# Altium project LimePSB-RPCM_1v5.PrjPcb (part 1 of 10)
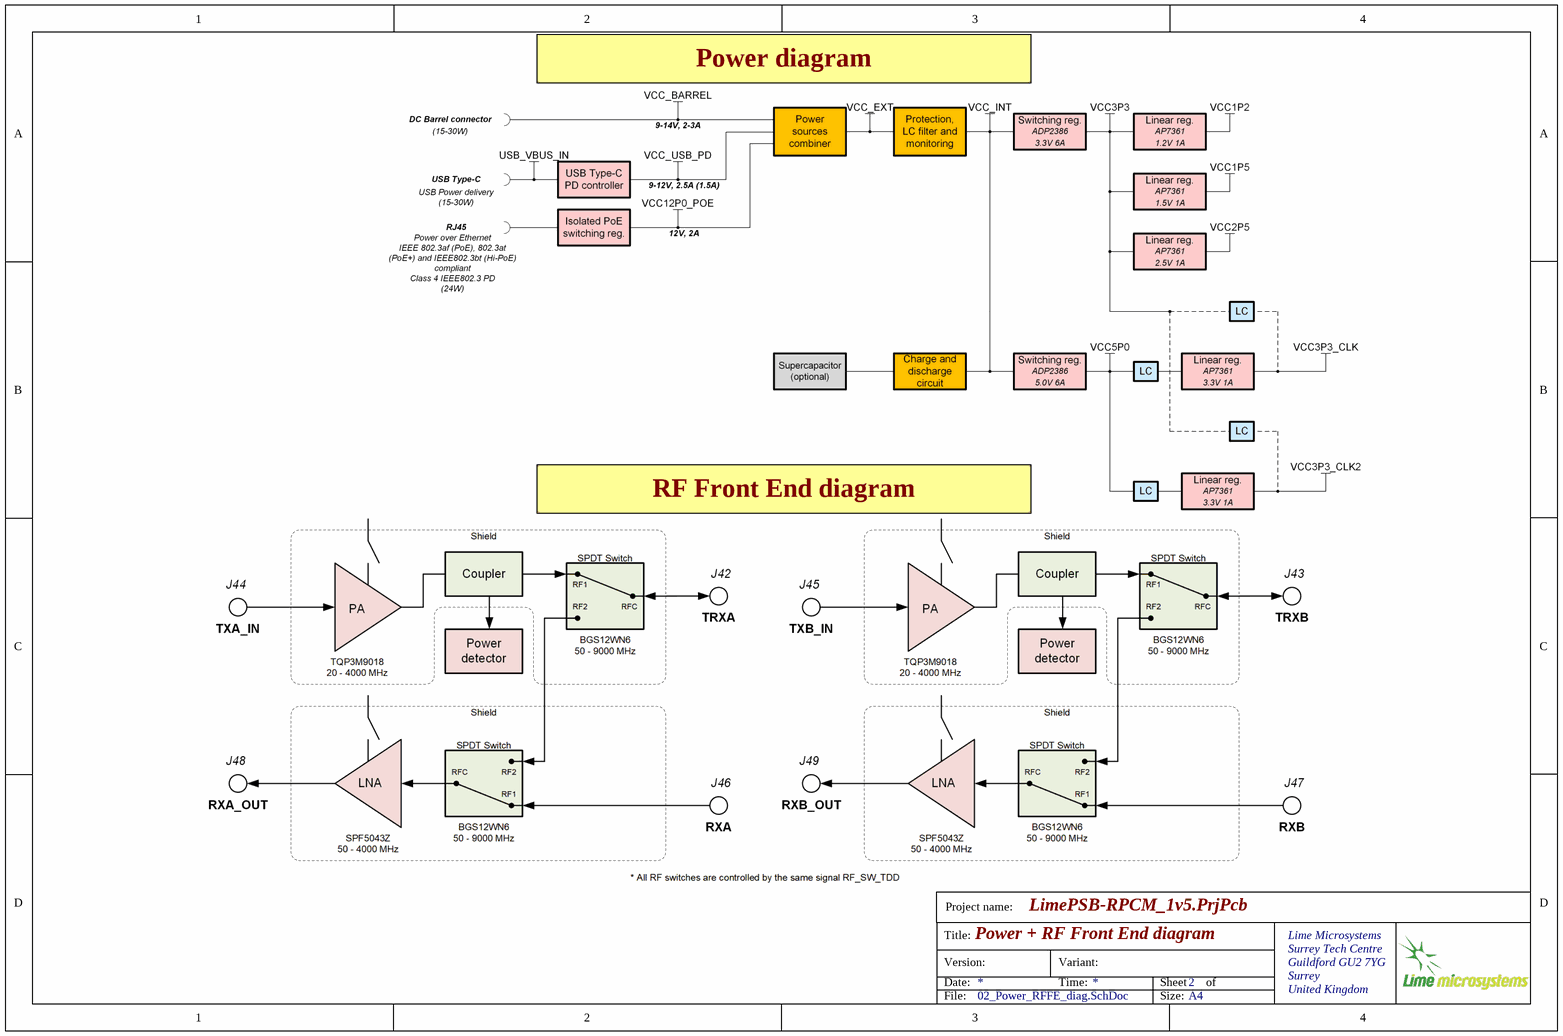
[diagram p0: 02_Power_RFFE_diag.SchDoc]
PROJECT_VERSION: 1.5; SHEET_TOTAL: 15
10 sheets, 793 parts. Net scope: global (net labels, ports and power ports of the same name join across sheets).
Board file: LimePSB-RPCM_1v5.PcbDoc
Sheets:
  02_Power_RFFE_diag.SchDoc
  03_Clock_diag.SchDoc
  05_RPi_mPCIe.SchDoc
  07_Misc_2.SchDoc
  08_FPGA.SchDoc
  11_Clock_1.SchDoc
  12_Clock_2.SchDoc
  13_RFFE.SchDoc
  14_RFPD_PoE_USB_PD.SchDoc
  15_Power.SchDoc

## Sheet 02_Power_RFFE_diag.SchDoc: Power + RF Front End diagram
size A4; Organization: Lime Microsystems; Address1: Surrey Tech Centre; Address2: Guildford GU2 7YG; Address3: Surrey; Address4: United Kingdom; Revision: 1.5; SheetNumber: 2; SheetTotal: 15

### Notes on the sheet
- Power diagram
- RF Front End diagram
- Project name:
- Title:
- Version:
- Date:
- Variant:
- Time:
- Sheet
- of
- File:
- Size:
- A4

## Sheet 03_Clock_diag.SchDoc: Clock diagram
size A4; Organization: Lime Microsystems; Address1: Surrey Tech Centre; Address2: Guildford GU2 7YG; Address3: Surrey; Address4: United Kingdom; Revision: 1.5; SheetNumber: 3; SheetTotal: 15
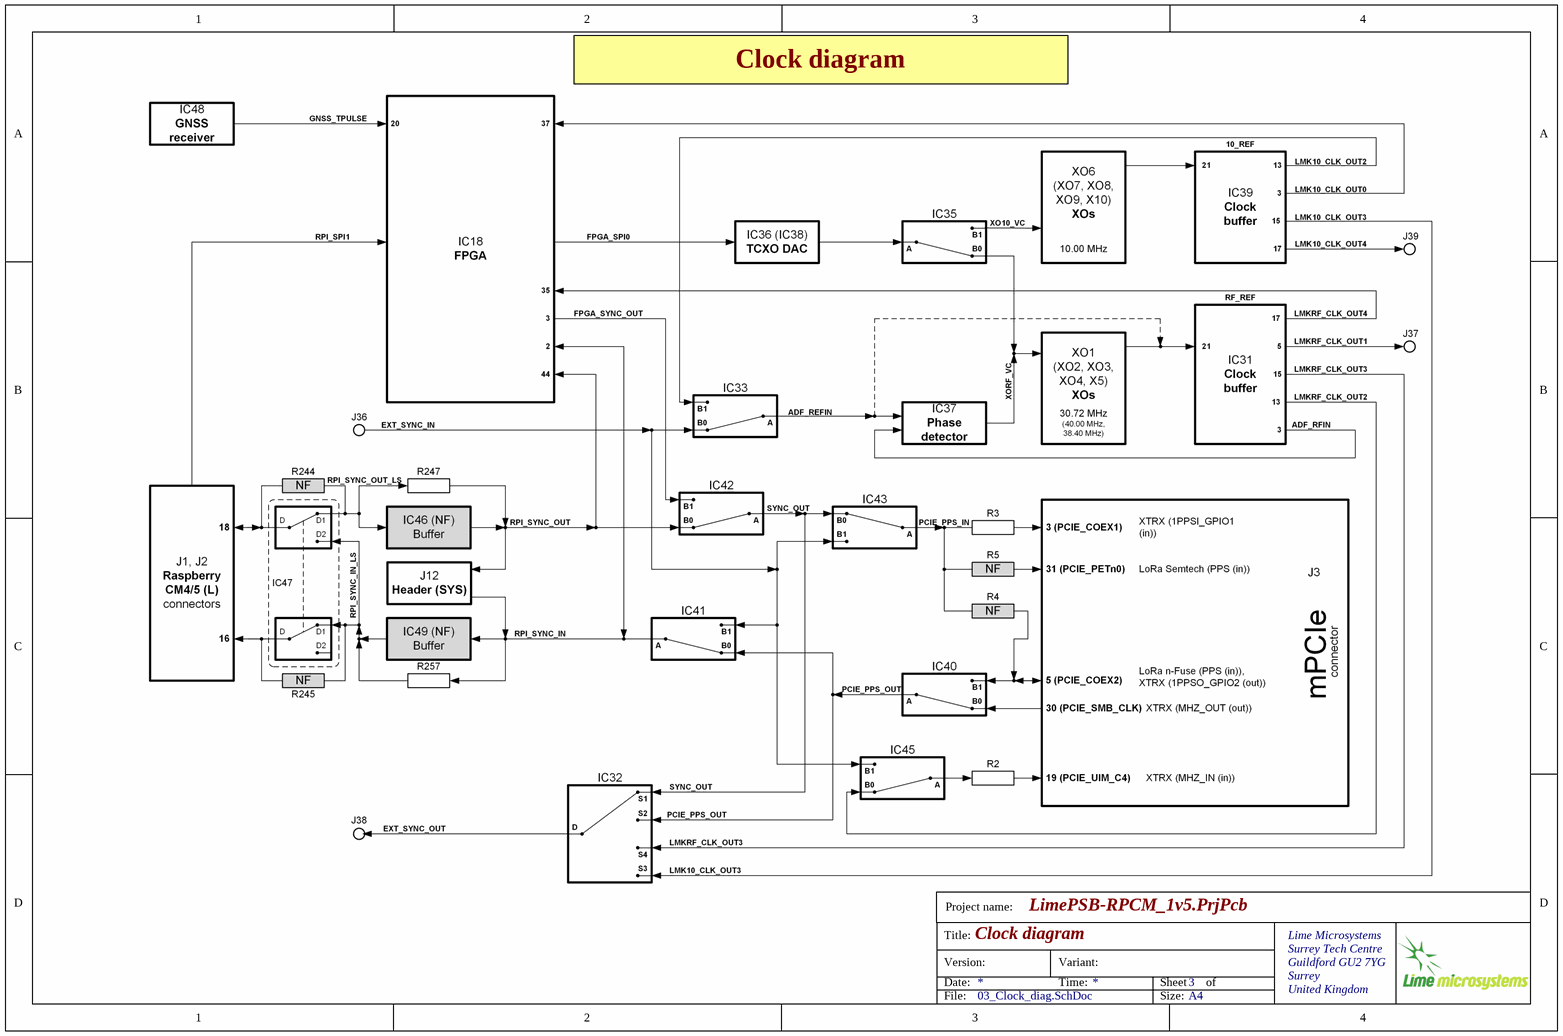
[diagram p1: 03_Clock_diag.SchDoc]

### Notes on the sheet
- Clock diagram
- Project name:
- Title:
- Version:
- Date:
- Variant:
- Time:
- Sheet
- of
- File:
- Size:
- A4

## Sheet 05_RPi_mPCIe.SchDoc: Raspberry Pi CM4/5(L) and mPCIe
size A3; Organization: Lime Microsystems; Address1: Surrey Tech Centre; Address2: Guildford GU2 7YG; Address3: Surrey; Address4: United Kingdom; Revision: 1.5; SheetNumber: 5; SheetTotal: 15
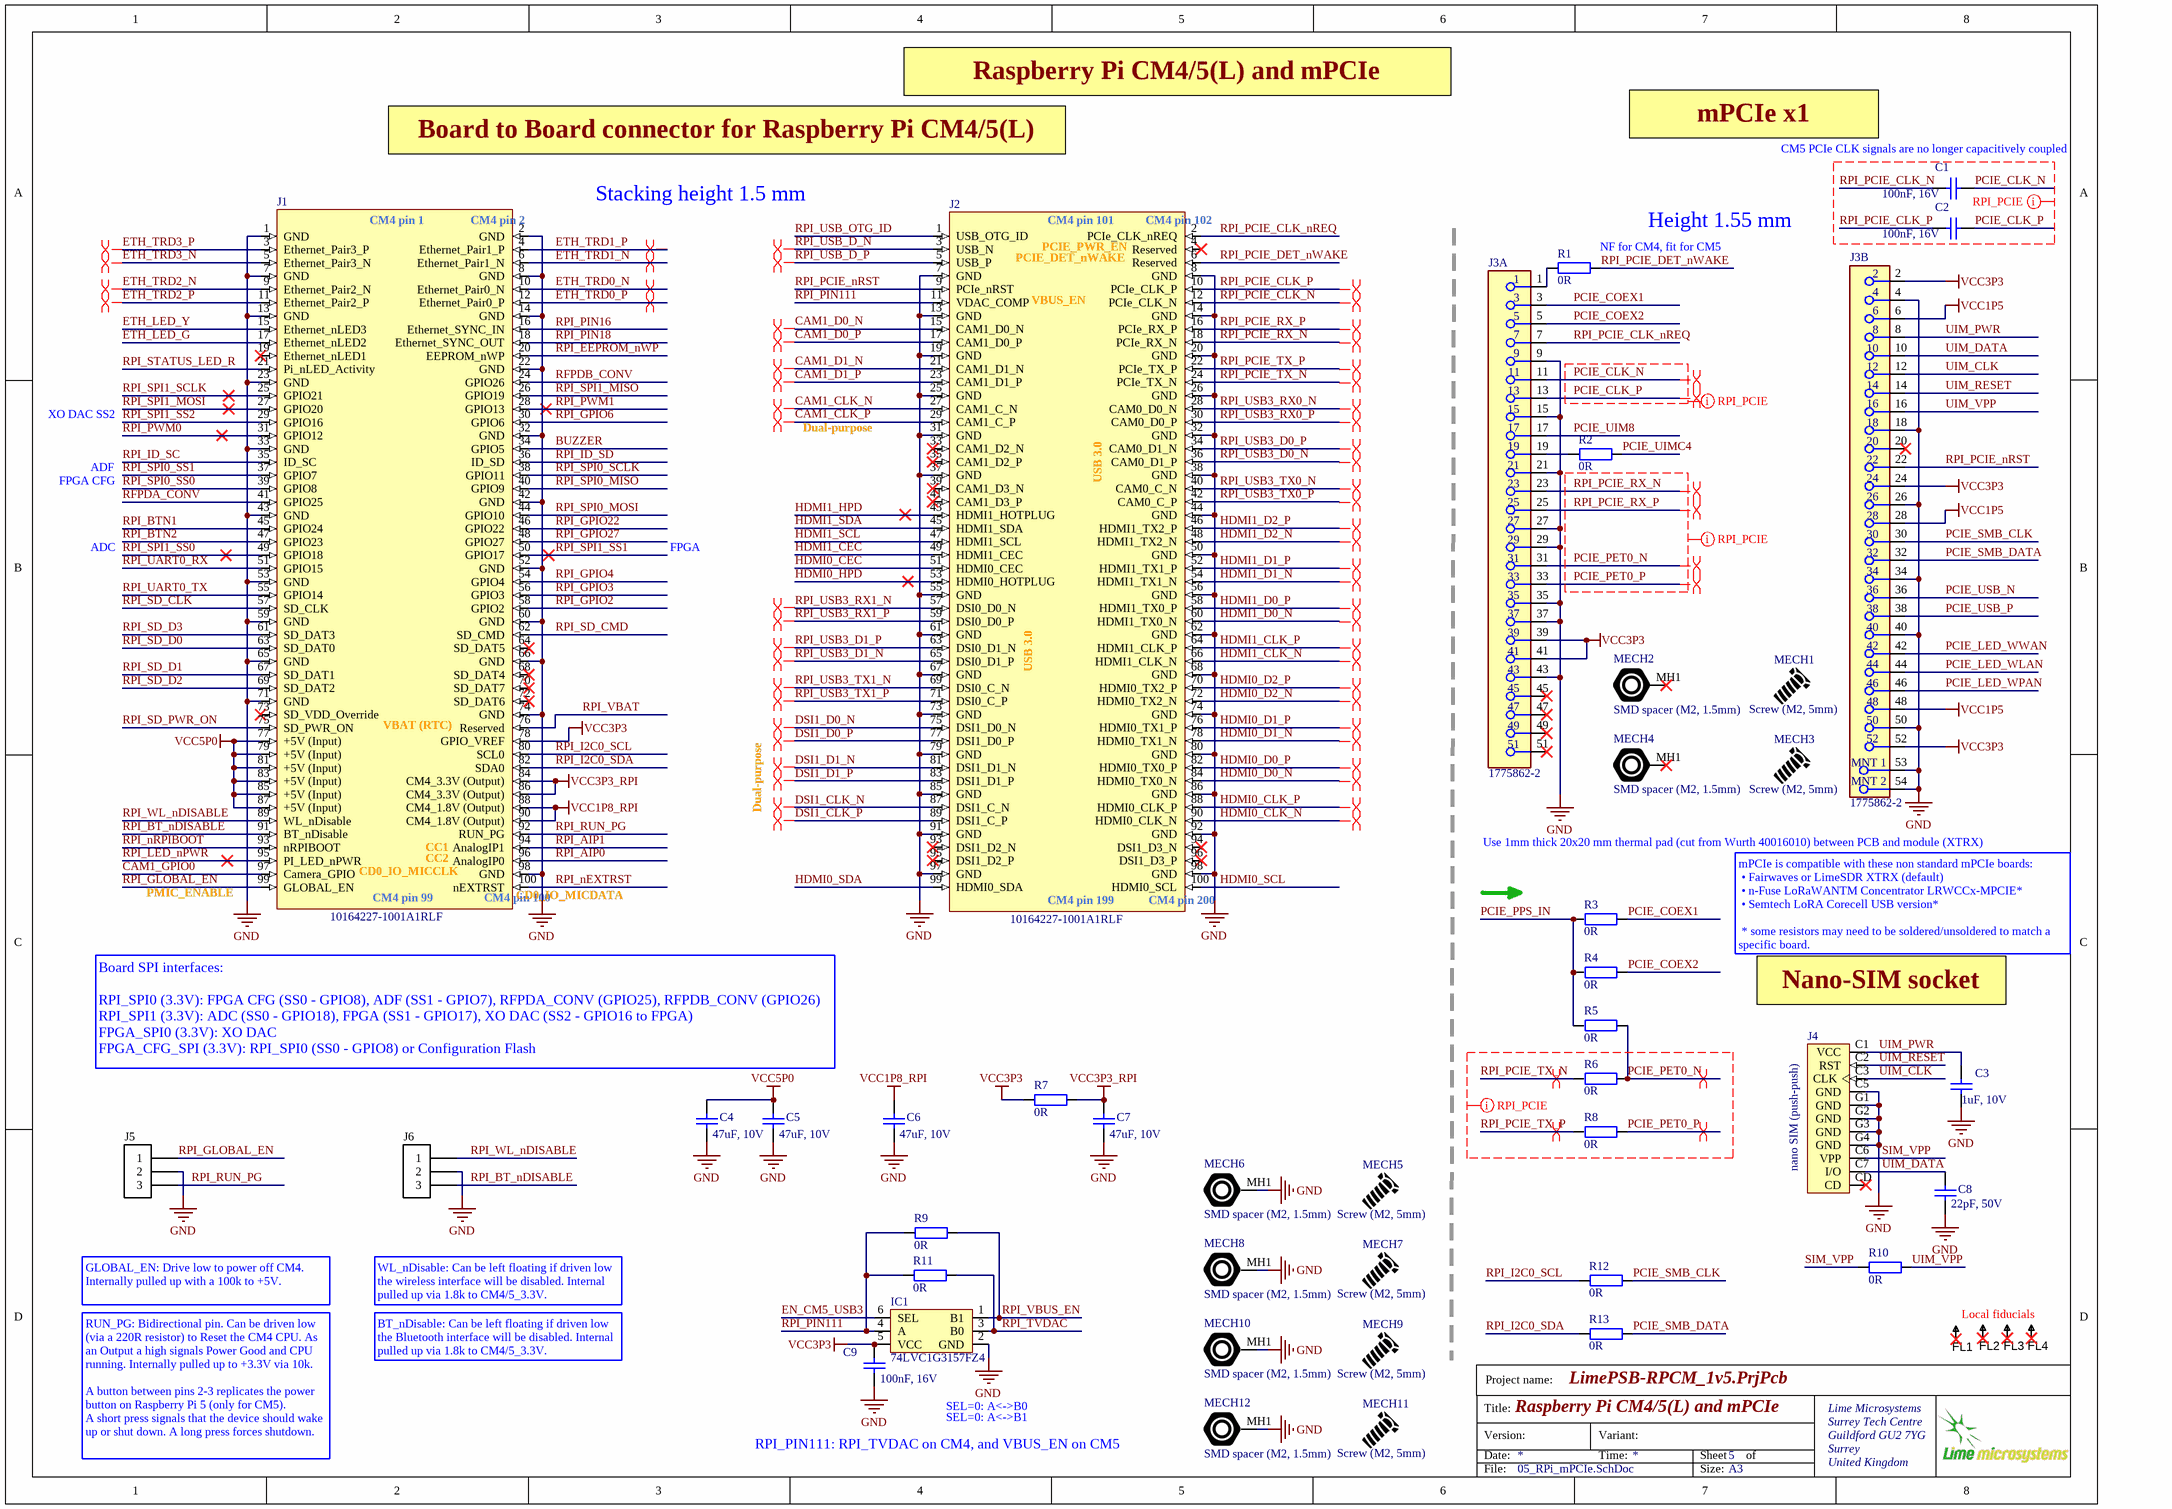
[diagram p2: 05_RPi_mPCIe.SchDoc]

### Parts
C1  100nF, 16V  [CAP0402]
C2  100nF, 16V  [CAP0402]
C3  1uF, 10V  [CAP0402]
C4  47uF, 10V  [CAP1206]
C5  47uF, 10V  [CAP1206]
C6  47uF, 10V  [CAP1206]
C7  47uF, 10V  [CAP1206]
C8  22pF, 50V  [CAP0402]
C9  100nF, 16V  [CAP0402]
FL1  Fiducial  [Fiducial_local]  (value not drawn)
FL2  Fiducial  [Fiducial_local]  (value not drawn)
FL3  Fiducial  [Fiducial_local]  (value not drawn)
FL4  Fiducial  [Fiducial_local]  (value not drawn)
IC1  74LVC1G3157FZ4  [74LVC1G3157FZ4_SPDT_SW_DFN1410-6]
J1  Manufacturer Part Number 1: 10164227-1001A1RLF  [FP-DF40C-100DS-0.4V(51)]  (hidden comment: Board to Board & Mezzanine Connectors BergStak 0.4mm, 100 position, Receptacle, 1.5mm stack height)
J2  Manufacturer Part Number 1: 10164227-1001A1RLF  [FP-DF40C-100DS-0.4V(51)]  (hidden comment: Board to Board & Mezzanine Connectors BergStak 0.4mm, 100 position, Receptacle, 1.5mm stack height)
J3  1775862-2  [MiniPCIe_connector_XTRX_v2]  (parts A,B of 2)
J4  nano SIM (push-push)  [nano_SIM_SIM8066-6-1-14-01-A]
J5  Header 3x1 pin  [HDR_1x3]  (value not drawn)
J6  Header 3x1 pin  [HDR_1x3]  (value not drawn)
MECH1  Screw (M2, 5mm)  (mechanical)
MECH2  SMD spacer (M2, 1.5mm)  [9774015243R_SMT_M2_STANDOFF_SPACER]
MECH3  Screw (M2, 5mm)  (mechanical)
MECH4  SMD spacer (M2, 1.5mm)  [9774015243R_SMT_M2_STANDOFF_SPACER]
MECH5  Screw (M2, 5mm)  (mechanical)
MECH6  SMD spacer (M2, 1.5mm)  [9774015243R_SMT_M2_STANDOFF_SPACER]
MECH7  Screw (M2, 5mm)  (mechanical)
MECH8  SMD spacer (M2, 1.5mm)  [9774015243R_SMT_M2_STANDOFF_SPACER]
MECH9  Screw (M2, 5mm)  (mechanical)
MECH10  SMD spacer (M2, 1.5mm)  [9774015243R_SMT_M2_STANDOFF_SPACER]
MECH11  Screw (M2, 5mm)  (mechanical)
MECH12  SMD spacer (M2, 1.5mm)  [9774015243R_SMT_M2_STANDOFF_SPACER]
R1  0R  [RES0402]
R2  0R  [RES0402_v2]
R3  0R  [RES0402]
R4  0R  [RES0402]
R5  0R  [RES0402]
R6  0R  [RES0402]
R7  0R  [RES0805]
R8  0R  [RES0402]
R9  0R  [RES0402]
R10  0R  [RES0402]
R11  0R  [RES0402]
R12  0R  [RES0402]
R13  0R  [RES0402]

### Nets
GND: C3.1 C4.1 C5.1 C6.1 C7.1 C8.1 C9.2 IC1.2(GND) J1.1(GND) J1.2(GND) J1.7(GND) J1.8(GND) J1.13(GND) J1.14(GND) J1.22(GND) J1.23(GND) J1.32(GND) J1.33(GND) J1.42(GND) J1.43(GND) J1.52(GND) J1.53(GND) J1.59(GND) J1.60(GND) J1.65(GND) J1.66(GND) J1.71(GND) J1.74(GND) J1.98(GND) J2.7(GND) J2.8(GND) J2.13(GND) J2.14(GND) J2.19(GND) J2.20(GND) J2.25(GND) J2.26(GND) J2.31(GND) J2.32(GND) J2.37(GND) J2.38(GND) J2.44(GND) J2.50(GND) J2.55(GND) J2.56(GND) J2.61(GND) J2.62(GND) J2.67(GND) J2.68(GND) J2.73(GND) J2.74(GND) J2.79(GND) J2.80(GND) J2.85(GND) J2.86(GND) J2.91(GND) J2.92(GND) J2.97(GND) J2.98(GND) J3.4 J3.9 J3.15 J3.18 J3.21 J3.26 J3.27 J3.29 J3.34 J3.35 J3.37 J3.40 J3.43 J3.50 J3.53(MNT_1) J3.54(MNT_2) J4.C5(GND) J4.G1(GND) J4.G2(GND) J4.G3(GND) J4.G4(GND) J5.2 J6.2 MECH6.MH1(GND) MECH8.MH1(GND) MECH10.MH1(GND) MECH12.MH1(GND)
VCC1P5: J3.6 J3.28 J3.48
VCC1P8_RPI: C6.2 J1.88(CM4_1.8V_(Output)) J1.90(CM4_1.8V_(Output))
VCC3P3: C9.1 IC1.5(VCC) J1.78(GPIO_VREF) J3.2 J3.24 J3.39 J3.41 J3.52 R7.2
VCC3P3_RPI: C7.2 J1.84(CM4_3.3V_(Output)) J1.86(CM4_3.3V_(Output)) R7.1
VCC5P0: C4.2 C5.2 J1.77(+5V_(Input)) J1.79(+5V_(Input)) J1.81(+5V_(Input)) J1.83(+5V_(Input)) J1.85(+5V_(Input)) J1.87(+5V_(Input))
BUZZER: J1.34(GPIO5)
CAM1_CLK_N: J2.27(CAM1_C_N)
CAM1_CLK_P: J2.29(CAM1_C_P)
CAM1_D0_N: J2.15(CAM1_D0_N)
CAM1_D0_P: J2.17(CAM1_D0_P)
CAM1_D1_N: J2.21(CAM1_D1_N)
CAM1_D1_P: J2.23(CAM1_D1_P)
CAM1_GPIO0: J1.97(Camera_GPIO)
DSI1_CLK_N: J2.87(DSI1_C_N)
DSI1_CLK_P: J2.89(DSI1_C_P)
DSI1_D0_N: J2.75(DSI1_D0_N)
DSI1_D0_P: J2.77(DSI1_D0_P)
DSI1_D1_N: J2.81(DSI1_D1_N)
DSI1_D1_P: J2.83(DSI1_D1_P)
EN_CM5_USB3: IC1.6(SEL)
ETH_LED_G: J1.17(Ethernet_nLED2)
ETH_LED_Y: J1.15(Ethernet_nLED3)
ETH_TRD0_N: J1.10(Ethernet_Pair0_N)
ETH_TRD0_P: J1.12(Ethernet_Pair0_P)
ETH_TRD1_N: J1.6(Ethernet_Pair1_N)
ETH_TRD1_P: J1.4(Ethernet_Pair1_P)
ETH_TRD2_N: J1.9(Ethernet_Pair2_N)
ETH_TRD2_P: J1.11(Ethernet_Pair2_P)
ETH_TRD3_N: J1.5(Ethernet_Pair3_N)
ETH_TRD3_P: J1.3(Ethernet_Pair3_P)
HDMI0_CEC: J2.51(HDMI0_CEC)
HDMI0_CLK_N: J2.90(HDMI0_CLK_N)
HDMI0_CLK_P: J2.88(HDMI0_CLK_P)
HDMI0_D0_N: J2.84(HDMI0_TX0_N)
HDMI0_D0_P: J2.82(HDMI0_TX0_P)
HDMI0_D1_N: J2.78(HDMI0_TX1_N)
HDMI0_D1_P: J2.76(HDMI0_TX1_P)
HDMI0_D2_N: J2.72(HDMI0_TX2_N)
HDMI0_D2_P: J2.70(HDMI0_TX2_P)
HDMI0_HPD: J2.53(HDMI0_HOTPLUG)
HDMI0_SCL: J2.100(HDMI0_SCL)
HDMI0_SDA: J2.99(HDMI0_SDA)
HDMI1_CEC: J2.49(HDMI1_CEC)
HDMI1_CLK_N: J2.66(HDMI1_CLK_N)
HDMI1_CLK_P: J2.64(HDMI1_CLK_P)
HDMI1_D0_N: J2.60(HDMI1_TX0_N)
HDMI1_D0_P: J2.58(HDMI1_TX0_P)
HDMI1_D1_N: J2.54(HDMI1_TX1_N)
HDMI1_D1_P: J2.52(HDMI1_TX1_P)
HDMI1_D2_N: J2.48(HDMI1_TX2_N)
HDMI1_D2_P: J2.46(HDMI1_TX2_P)
HDMI1_HPD: J2.43(HDMI1_HOTPLUG)
HDMI1_SCL: J2.47(HDMI1_SCL)
HDMI1_SDA: J2.45(HDMI1_SDA)
PCIE_CLK_N: C1.1 J3.11
PCIE_CLK_P: C2.1 J3.13
PCIE_COEX1: J3.3 R3.1
PCIE_COEX2: J3.5 R4.1
PCIE_LED_WLAN: J3.44
PCIE_LED_WPAN: J3.46
PCIE_LED_WWAN: J3.42
PCIE_PET0_N: J3.31 R5.1 R6.1
PCIE_PET0_P: J3.33 R8.1
PCIE_PPS_IN: R3.2 R4.2 R5.2
PCIE_SMB_CLK: J3.30 R12.1
PCIE_SMB_DATA: J3.32 R13.1
PCIE_UIM8: J3.17
PCIE_UIMC4: R2.1
PCIE_USB_N: J3.36
PCIE_USB_P: J3.38
RFPDA_CONV: J1.41(GPIO25)
RFPDB_CONV: J1.24(GPIO26)
RPI_AIP0: J1.96(AnalogIP0)
RPI_AIP1: J1.94(AnalogIP1)
RPI_BT_nDISABLE: J1.91(BT_nDisable) J6.3
RPI_BTN1: J1.45(GPIO24)
RPI_BTN2: J1.47(GPIO23)
RPI_EEPROM_nWP: J1.20(EEPROM_nWP)
RPI_GLOBAL_EN: J1.99(GLOBAL_EN) J5.1
RPI_GPIO2: J1.58(GPIO2)
RPI_GPIO3: J1.56(GPIO3)
RPI_GPIO4: J1.54(GPIO4)
RPI_GPIO6: J1.30(GPIO6)
RPI_GPIO22: J1.46(GPIO22)
RPI_GPIO27: J1.48(GPIO27)
RPI_I2C0_SCL: J1.80(SCL0) R12.2
RPI_I2C0_SDA: J1.82(SDA0) R13.2
RPI_ID_SC: J1.35(ID_SC)
RPI_ID_SD: J1.36(ID_SD)
RPI_LED_nPWR: J1.95(PI_LED_nPWR)
RPI_nEXTRST: J1.100(nEXTRST)
RPI_nRPIBOOT: J1.93(nRPIBOOT)
RPI_PCIE_CLK_N: C1.2 J2.12(PCIe_CLK_N)
RPI_PCIE_CLK_nREQ: J2.2(PCIe_CLK_nREQ) J3.7
RPI_PCIE_CLK_P: C2.2 J2.10(PCIe_CLK_P)
RPI_PCIE_DET_nWAKE: J2.6(Reserved) R1.1
RPI_PCIE_nRST: J2.9(PCIe_nRST) J3.22
RPI_PCIE_RX_N: J2.18(PCIe_RX_N) J3.23
RPI_PCIE_RX_P: J2.16(PCIe_RX_P) J3.25
RPI_PCIE_TX_N: J2.24(PCIe_TX_N) R6.2
RPI_PCIE_TX_P: J2.22(PCIe_TX_P) R8.2
RPI_PIN16: J1.16(Ethernet_SYNC_IN)
RPI_PIN18: J1.18(Ethernet_SYNC_OUT)
RPI_PIN111: IC1.4(A) J2.11(VDAC_COMP) R9.2 R11.2
RPI_PWM0: J1.31(GPIO12)
RPI_PWM1: J1.28(GPIO13)
RPI_RUN_PG: J1.92(RUN_PG) J5.3
RPI_SD_CLK: J1.57(SD_CLK)
RPI_SD_CMD: J1.62(SD_CMD)
RPI_SD_D0: J1.63(SD_DAT0)
RPI_SD_D1: J1.67(SD_DAT1)
RPI_SD_D2: J1.69(SD_DAT2)
RPI_SD_D3: J1.61(SD_DAT3)
RPI_SD_PWR_ON: J1.75(SD_PWR_ON)
RPI_SPI0_MISO: J1.40(GPIO9)
RPI_SPI0_MOSI: J1.44(GPIO10)
RPI_SPI0_SCLK: J1.38(GPIO11)
RPI_SPI0_SS0: J1.39(GPIO8)
RPI_SPI0_SS1: J1.37(GPIO7)
RPI_SPI1_MISO: J1.26(GPIO19)
RPI_SPI1_MOSI: J1.27(GPIO20)
RPI_SPI1_SCLK: J1.25(GPIO21)
RPI_SPI1_SS0: J1.49(GPIO18)
RPI_SPI1_SS1: J1.50(GPIO17)
RPI_SPI1_SS2: J1.29(GPIO16)
RPI_STATUS_LED_R: J1.21(Pi_nLED_Activity)
RPI_TVDAC: IC1.3(B0) R11.1
RPI_UART0_RX: J1.51(GPIO15)
RPI_UART0_TX: J1.55(GPIO14)
RPI_USB3_D0_N: J2.36(CAM0_D1_P)
RPI_USB3_D0_P: J2.34(CAM0_D1_N)
RPI_USB3_D1_N: J2.65(DSI0_D1_P)
RPI_USB3_D1_P: J2.63(DSI0_D1_N)
RPI_USB3_RX0_N: J2.28(CAM0_D0_N)
RPI_USB3_RX0_P: J2.30(CAM0_D0_P)
RPI_USB3_RX1_N: J2.57(DSI0_D0_N)
RPI_USB3_RX1_P: J2.59(DSI0_D0_P)
RPI_USB3_TX0_N: J2.40(CAM0_C_N)
RPI_USB3_TX0_P: J2.42(CAM0_C_P)
RPI_USB3_TX1_N: J2.69(DSI0_C_N)
RPI_USB3_TX1_P: J2.71(DSI0_C_P)
RPI_USB_D_N: J2.3(USB_N)
RPI_USB_D_P: J2.5(USB_P)
RPI_USB_OTG_ID: J2.1(USB_OTG_ID)
RPI_VBAT: J1.76(Reserved)
RPI_VBUS_EN: IC1.1(B1) R9.1
RPI_WL_nDISABLE: J1.89(WL_nDisable) J6.1
SIM_VPP: J4.C6(VPP) R10.2
UIM_CLK: J3.12 J4.C3(CLK)
UIM_DATA: C8.2 J3.10 J4.C7(I/O)
UIM_PWR: C3.2 J3.8 J4.C1(VCC)
UIM_RESET: J3.14 J4.C2(RST)
UIM_VPP: J3.16 R10.1
NetJ3_1: J3.1 R1.2
NetJ3_19: J3.19 R2.2

Not connected (* = marked no-connect by the designer): FL1 1*; FL2 1*; FL3 1*; FL4 1*; J1 19(Ethernet_nLED1)* 64(SD_DAT5)* 68(SD_DAT4)* 70(SD_DAT7)* 72(SD_DAT6)* 73(SD_VDD_Override)*; J2 4(Reserved)* 33(CAM1_D2_N)* 35(CAM1_D2_P)* 39(CAM1_D3_N)* 41(CAM1_D3_P)* 93(DSI1_D2_N)* 94(DSI1_D3_N)* 95(DSI1_D2_P)* 96(DSI1_D3_P)*; J3 20* 45* 47* 49* 51*; J4 CD*; MECH2 MH1(GND)*; MECH4 MH1(GND)*

### Layout directives
differential pair: CAM1_CLK_N, CAM1_CLK_P, CAM1_D0_N, CAM1_D0_P, CAM1_D1_N, CAM1_D1_P, DSI1_CLK_N, DSI1_CLK_P, DSI1_D0_N, DSI1_D0_P, DSI1_D1_N, DSI1_D1_P, ETH_TRD0_N, ETH_TRD0_P, ETH_TRD1_N, ETH_TRD1_P, ETH_TRD2_N, ETH_TRD2_P, ETH_TRD3_N, ETH_TRD3_P, HDMI0_CLK_N, HDMI0_CLK_P, HDMI0_D0_N, HDMI0_D0_P, HDMI0_D1_N, HDMI0_D1_P, HDMI0_D2_N, HDMI0_D2_P, HDMI1_CLK_N, HDMI1_CLK_P, HDMI1_D0_N, HDMI1_D0_P, HDMI1_D1_N, HDMI1_D1_P, HDMI1_D2_N, HDMI1_D2_P, PCIE_CLK_N, PCIE_CLK_P, PCIE_PET0_N, PCIE_PET0_P, RPI_PCIE_CLK_N, RPI_PCIE_CLK_P, RPI_PCIE_RX_N, RPI_PCIE_RX_P, RPI_PCIE_TX_N, RPI_PCIE_TX_P, RPI_USB3_D0_N, RPI_USB3_D0_P, RPI_USB3_D1_N, RPI_USB3_D1_P, RPI_USB3_RX0_N, RPI_USB3_RX0_P, RPI_USB3_RX1_N, RPI_USB3_RX1_P, RPI_USB3_TX0_N, RPI_USB3_TX0_P, RPI_USB3_TX1_N, RPI_USB3_TX1_P, RPI_USB_D_N, RPI_USB_D_P
net class RPI_PCIE: PCIE_CLK_N, PCIE_CLK_P, PCIE_PET0_N, PCIE_PET0_P, RPI_PCIE_CLK_N, RPI_PCIE_CLK_P, RPI_PCIE_RX_N, RPI_PCIE_RX_P, RPI_PCIE_TX_N, RPI_PCIE_TX_P

### Notes on the sheet
- Raspberry Pi CM4/5(L) and mPCIe
- Board to Board connector for Raspberry Pi CM4/5(L)
- mPCIe x1
- (near C1) CM5 PCIe CLK signals are no longer capacitively coupled
- Stacking height 1.5 mm
- (near J2) PCIE_PWR_EN
- (near R1) NF for CM4, fit for CM5
- Height 1.55 mm
- (near J2) PCIE_DET_nWAKE
- (near J2) VBUS_EN
- XO DAC SS2
- Dual-purpose
- FPGA CFG
- ADF
- (near J2) USB 3.0
- ADC
- FPGA
- (near J1) VBAT (RTC)
- (near J1) CC1
- Use 1mm thick 20x20 mm thermal pad (cut from Wurth 40016010) between PCB and module (XTRX)
- PMIC_ENABLE
- (near J1) CD0_IO_MICCLK
- (near J1) CC2
- (near J1) CD0_IO_MICDATA
- mPCIe is compatible with these non standard mPCIe boards:
  • Fairwaves or LimeSDR XTRX (default)
  • n-Fuse LoRaWANTM Concentrator LRWCCx-MPCIE*
  • Semtech LoRA Corecell USB version*
  * some resistors may need to be soldered/unsoldered to match a specific board.
- Nano-SIM socket
- Board SPI interfaces:
  RPI_SPI0 (3.3V): FPGA CFG (SS0 - GPIO8), ADF (SS1 - GPIO7), RFPDA_CONV (GPIO25), RFPDB_CONV (GPIO26)
  RPI_SPI1 (3.3V): ADC (SS0 - GPIO18), FPGA (SS1 - GPIO17), XO DAC (SS2 - GPIO16 to FPGA)
  FPGA_SPI0 (3.3V): XO DAC
  FPGA_CFG_SPI (3.3V): RPI_SPI0 (SS0 - GPIO8) or Configuration Flash
- GLOBAL_EN: Drive low to power off CM4. Internally pulled up with a 100k to +5V.
- WL_nDisable: Can be left floating if driven low the wireless interface will be disabled. Internal pulled up via 1.8k to CM4/5_3.3V.
- Local fiducials
- BT_nDisable: Can be left floating if driven low the Bluetooth interface will be disabled. Internal pulled up via 1.8k to CM4/5_3.3V.
- RUN_PG: Bidirectional pin. Can be driven low (via a 220R resistor) to Reset the CM4 CPU. As an Output a high signals Power Good and CPU running. Internally pulled up to +3.3V via 10k.
  A button between pins 2-3 replicates the power button on Raspberry Pi 5 (only for CM5).
  A short press signals that the device should wake up or shut down. A long press forces shutdown.
- RPI_PIN111: RPI_TVDAC on CM4, and VBUS_EN on CM5
- SEL=0: A<->B0
- SEL=0: A<->B1
- Project name:
- Title:
- Version:
- Date:
- Variant:
- Time:
- Sheet
- of
- File:
- Size:
- A3
- (in symbol cm4_high_speed) CM4 pin 101; CM4 pin 102; CM4 pin 199; CM4 pin 200
- (in symbol cm4_misc_GPIO) CM4 pin 1; CM4 pin 2; CM4 pin 99; CM4 pin 100

### Library data of the parts
C1 C2 = Cap_0603: Manufacturer Part Number 1: GRM155R71C104KA88D; Part Description: 0.10µF ±10% 16V Ceramic Capacitor X7R 0402 (1005 Metric); Brand: Murata Electronics; Tolerance: 10 %; Type: General Purpose MLCC; Capacitance: 0.1 uF; Temperature Coefficient / Code: +/- 15 %; Supplier 1: Mouser; Supplier Part Number 1: 81-GRM155R71C104KA88; Case Code - in: 0402; Manufacturer: Murata Electronics; Category: Multilayer Ceramic Capacitors MLCC - SMD/SMT; Voltage Rating DC: 16 V; Value: 100nF, 16V; Maximum Operating Temperature: + 125 C; Minimum Operating Temperature: - 55 C; Minimum Order Quantity: 1; Operating Temperature Range: - 55 C to + 125 C; Package / Case: 0402 (1005 metric); Packaging: Reel; Product: General Type MLCCs; Product Category: Low & Medium Capacitance SMD Ceramic Chip Capacitors; Reeling: True; RoHS - Mouser: Y; RoHS: RoHS Compliant; Series: GRM; Standard Pack Qty: 10000; Termination Style: SMD/SMT; Manufacturer Part Number: GRM155R71C104KA88D
C3 = Cap_0402: CAP CER 1UF 10V X5R 0402; Manufacturer: Yageo; Part Description: 1µF 10V Ceramic Capacitor X5R 0402 (1005 Metric) 0.039" L x 0.020" W (1.00mm x 0.50mm); Manufacturer Part Number 1: CC0402MRX5R6BB105; Notification: Current market demand for these product types have resulted in fluctuating and extending lead times. Lead times may differ.; Tolerance: ±20%; Value: 1uF, 10V; Supplier 1: Digi-Key; Supplier Part Number 1: 311-1732-1-ND; RoHS: RoHS Compliant; Applications: General Purpose; Category: Capacitors; ComponentLink1Description: http://www.yageo.com/documents/recent/UPY-GPHC_X5R_4V-to-50V_25.pdf; ComponentLink1URL: http://www.yageo.com/documents/recent/UPY-GPHC_X5R_4V-to-50V_25.pdf; Failure Rate: -; Features: -; Height - Seated (Max): -; Lead Spacing: -; Lead Style: -; Mounting Type: Surface Mount, MLCC; Operating Temperature: -55°C ~ 85°C; Package / Case: 0402 (1005 Metric); Packaging: Cut Tape (CT); Part Status: Active; Pricing 1: 1=0.22, 10=0.156, 100=0.0732, 500=0.0513, 1000=0.04248, 2500=0.03953, 5000=0.03617 (USD); Ratings: -; Size / Dimension: 0.039" L x 0.020" W (1.00mm x 0.50mm); Stock 1: 69600; Temperature Coefficient: X5R; Thickness (Max): 0.022" (0.55mm); Voltage - Rated: 10V
C4-C7 = Cap_1206: Manufacturer: TDK Corporation; Manufacturer Part Number 1: C3216X6S1A476M160AC; Part Description: 47µF ±20% 10V Ceramic Capacitor X6S 1206 (3216 Metric); Notification: Current market demand for these product types have resulted in fluctuating and extending lead times. Lead times may differ.; Tolerance: ±20%; Temperature Coefficient: X6S; Value: 47uF, 10V; RoHS: RoHS Compliant; Packaging: Cut Tape (CT); Operating Temperature: -55°C ~ 105°C; Voltage - Rated: 10V; Height - Seated (Max): -; Ratings: -; Applications: General Purpose; Features: Low ESL; Size / Dimension: 0.126" L x 0.063" W (3.20mm x 1.60mm); Supplier 1: Digi-Key; Lead Spacing: -; Supplier Part Number 1: 445-6010-1-ND; Thickness (Max): 0.071" (1.80mm); Failure Rate: -; Category: Capacitors; Lead Style: -; Part Status: Active; Mounting Type: Surface Mount, MLCC; Package / Case: 1206 (3216 Metric)
C8 = Cap_0402: Manufacturer: Yageo; Manufacturer Part Number 1: CC0402JRNPO9BN220; Part Description: 22pF ±5% 50V C0G, NP0 Ceramic Capacitor -55°C ~ 125°C Surface Mount, MLCC 0402 (1005 Metric) 0.039" L x 0.020" W (1.00mm x 0.50mm); Tolerance: ±5%; Temperature Coefficient: C0G, NP0; Value: 22pF, 50V; Supplier 1: Digi-Key; Supplier Part Number 1: 311-1018-2-ND; Category: Capacitors; Voltage - Rated: 50V; Packaging: Tape & Reel (TR); RoHS: RoHS Compliant; Capacitance: 22pF; Operating Temperature: -55°C ~ 125°C; Mounting Type: Surface Mount, MLCC; Height - Seated (Max): -; Size / Dimension: 0.039" L x 0.020" W (1.00mm x 0.50mm); Ratings: -; Applications: General Purpose; Thickness (Max): 0.022" (0.55mm); Lead Spacing: -; Lead Style: -; Features: -; Package / Case: 0402 (1005 Metric)
C9 = Cap_0603: Manufacturer Part Number 1: GRM155R71C104KA88D; Part Description: 0.10µF ±10% 16V Ceramic Capacitor X7R 0402 (1005 Metric); Brand: Murata Electronics; Tolerance: 10 %; Type: General Purpose MLCC; Capacitance: 0.1 uF; Temperature Coefficient / Code: +/- 15 %; Case Height: 0.5 mm; Case Length: 1 mm; Dielectric: X7R; Supplier 1: Mouser; Supplier Part Number 1: 81-GRM155R71C104KA88; Case Code - in: 0402; Manufacturer: Murata Electronics; Category: Multilayer Ceramic Capacitors MLCC - SMD/SMT; Voltage Rating DC: 16 V; Value: 100nF, 16V; Manufacturer Part Number: GRM155R71C104KA88D; Case Code - mm: 1005; Case Width: 0.5 mm; Maximum Operating Temperature: + 125 C; Minimum Operating Temperature: - 55 C; Minimum Order Quantity: 1; Operating Temperature Range: - 55 C to + 125 C; Package / Case: 0402 (1005 metric); Packaging: Reel; Product: General Type MLCCs; Product Category: Low & Medium Capacitance SMD Ceramic Chip Capacitors; Reeling: True; RoHS - Mouser: Y; RoHS: RoHS Compliant; Series: GRM; Standard Pack Qty: 10000; Termination Style: SMD/SMT
IC1 = 74LVC1G3157FZ4_SPDT_SW: Part Description: 1 Circuit IC Switch 2:1 10Ohm X2-DFN1410-6; Manufacturer: Diodes; Manufacturer Part Number 1: 74LVC1G3157FZ4-7; Number of Circuits: 1; On-State Resistance: 10R; -3db Bandwidth: 300MHz; Supplier 1: Digi-Key; Supplier Part Number 1: 74LVC1G3157FZ4-7DICT-ND; Stock 1: 158709; Pricing 1: 1=0,42000, 10=0,31200, 25=0,27320, 100=0,17670, 250=0,14628, 500=0,11702, 1000=0,08972, 2500=0,07802 (USD); RoHS: Yes; Number of Pins: 6; Min Operating Temperature: -40°C; Max Operating Temperature: 125°C; Packaging: Tape and Reel; RoHS Compliant: Yes; ComponentLink1URL: https://www.diodes.com/assets/Datasheets/74LVC1G3157.pdf?src-supplier=Digi-Key; ComponentLink1Description: https://www.diodes.com/assets/Datasheets/74LVC1G3157.pdf?src-supplier=Digi-Key; ComponentLink2URL: https://www.diodes.com/assets/product-showcases/74LVC3157-NPA-0516.pdf?src-supplier=Digi-Key; ComponentLink2Description: https://www.diodes.com/assets/product-showcases/74LVC3157-NPA-0516.pdf?src-supplier=Digi-Key
J1 = cm4_misc_GPIO: Manufacturer: Amphenol ICC / FCI; ComponentLink1URL: https://datasheet.ciiva.com/13559/ed-df40-20140305-13559540.pdf?src-supplier=Mouser; ComponentLink1Description: https://datasheet.ciiva.com/13559/ed-df40-20140305-13559540.pdf?src-supplier=Mouser; ComponentLink2URL: https://datasheet.ciiva.com/18562/ed-df40-20140305-18562462.pdf?src-supplier=Digi-Key; ComponentLink2Description: https://datasheet.ciiva.com/18562/ed-df40-20140305-18562462.pdf?src-supplier=Digi-Key; ComponentLink3URL: https://datasheet.ciiva.com/26948/getdatasheetpartid-441624-26948933.pdf?src-supplier=Verical; ComponentLink3Description: https://datasheet.ciiva.com/26948/getdatasheetpartid-441624-26948933.pdf?src-supplier=Verical; ComponentLink4URL: https://datasheet.ciiva.com/46408/1824826-46408894.pdf?src-supplier=Element14; ComponentLink4Description: https://datasheet.ciiva.com/46408/1824826-46408894.pdf?src-supplier=Element14; Part Description: Board to Board & Mezzanine Connectors BergStak 0.4mm, 100 position, Receptacle, 1.5mm stack height; Supplier 1: Mouser; Supplier Part Number 1: 649-01642271001A1RLF; Stock 1: 2838; Pricing 1: 1=1,67, 10=1,37, 50=1,37, 100=1,18, 1000=0,92, 10000=0,804 (USD); RoHS: No
J2 = cm4_high_speed: Manufacturer: Amphenol ICC / FCI; ComponentLink1URL: https://datasheet.ciiva.com/13559/ed-df40-20140305-13559540.pdf?src-supplier=Mouser; ComponentLink1Description: https://datasheet.ciiva.com/13559/ed-df40-20140305-13559540.pdf?src-supplier=Mouser; ComponentLink2URL: https://datasheet.ciiva.com/18562/ed-df40-20140305-18562462.pdf?src-supplier=Digi-Key; ComponentLink2Description: https://datasheet.ciiva.com/18562/ed-df40-20140305-18562462.pdf?src-supplier=Digi-Key; ComponentLink3URL: https://datasheet.ciiva.com/26948/getdatasheetpartid-441624-26948933.pdf?src-supplier=Verical; ComponentLink3Description: https://datasheet.ciiva.com/26948/getdatasheetpartid-441624-26948933.pdf?src-supplier=Verical; ComponentLink4URL: https://datasheet.ciiva.com/46408/1824826-46408894.pdf?src-supplier=Element14; ComponentLink4Description: https://datasheet.ciiva.com/46408/1824826-46408894.pdf?src-supplier=Element14; Part Description: Board to Board & Mezzanine Connectors BergStak 0.4mm, 100 position, Receptacle, 1.5mm stack height; Supplier 1: Mouser; Supplier Part Number 1: 649-01642271001A1RLF; Stock 1: 2838; Pricing 1: 1=1,67, 10=1,37, 50=1,37, 100=1,18, 1000=0,92, 10000=0,804 (USD); RoHS: No
J3 = MINI_PCIE_FEMALE: CONN PCI EXP MINI FEMALE 52POS; Manufacturer: JAE Electronics; Manufacturer Part Number 1: MM60-52B1-G1-R850; Part Description: 52 Position Female Connector PCI Express Mini Card Gold 0.031" (0.80mm); Additional Info: Additionally a required number of thermal pads (P/N 40016010) per batch of boards, rounding this number to whole pad pieces, have to be ordered (included in BOM Additional Info column). The thermal pad with a size of 100 mm x 100 mm is to be cut in 20 mm x 20 mm pieces (resulting in a possible total of 25 pcs. from a single whole pad). A single assembled PCB requires 1 pcs. of 20 mm x 20 mm pad per 1 board. Calculate the number of whole thermal pad (P/N 40016010) pieces based on the assembled board batch size, rounding this number to whole pad pieces. Example: 5 pcs. PCB batch requires 1 pcs. of thermal pad (P/N 40016010) with leftovers. 300 pcs. PCB batch requires 12 pcs. of thermal pads (P/N 40016010) without leftovers.; ComponentLink1URL: https://www.mouser.com/ds/2/418/NG_DS_8-1773459-7_EXPRESS_MINI_CARD_QRG_0816-907003.pdf?src-supplier=Mouser; ComponentLink1Description: https://www.mouser.com/ds/2/418/NG_DS_8-1773459-7_EXPRESS_MINI_CARD_QRG_0816-907003.pdf?src-supplier=Mouser; ComponentLink2URL: http://www.farnell.com/datasheets/2645681.pdf?src-supplier=Newark; ComponentLink2Description: http://www.farnell.com/datasheets/2645681.pdf?src-supplier=Newark; ComponentLink3URL: https://www.te.com/commerce/DocumentDelivery/DDEController?Action=srchrtrv&DocNm=108-99102&DocType=SS&DocLang=EN&src-supplier=Digi-Key; ComponentLink3Description: https://www.te.com/commerce/DocumentDelivery/DDEController?Action=srchrtrv&DocNm=108-99102&DocType=SS&DocLang=EN&src-supplier=Digi-Key; ComponentLink4URL: https://www.te.com/commerce/DocumentDelivery/DDEController?Action=srchrtrv&amp;DocNm=108-99102&amp;DocType=SS&amp;DocLang=EN&src-supplier=Digi-Key; ComponentLink4Description: https://www.te.com/commerce/DocumentDelivery/DDEController?Action=srchrtrv&amp;DocNm=108-99102&amp;DocType=SS&amp;DocLang=EN&src-supplier=Digi-Key; ComponentLink5URL: http://www.te.com/commerce/DocumentDelivery/DDEController?Action=showdoc&DocId=Customer+Drawing%7F2041262%7FC%7Fpdf%7FEnglish%7FENG_CD_2041262_C.pdf&src-supplier=Avnet; ComponentLink5Description: http://www.te.com/commerce/DocumentDelivery/DDEController?Action=showdoc&DocId=Customer+Drawing%7F2041262%7FC%7Fpdf%7FEnglish%7FENG_CD_2041262_C.pdf&src-supplier=Avnet; ComponentLink6URL: http://www.te.com/commerce/DocumentDelivery/DDEController?Action=srchrtrv&DocNm=2041262&DocType=Customer+Drawing&DocLang=English&src-supplier=Digi-Key; ComponentLink6Description: http://www.te.com/commerce/DocumentDelivery/DDEController?Action=srchrtrv&DocNm=2041262&DocType=Customer+Drawing&DocLang=English&src-supplier=Digi-Key; Supplier 1: Digi-Key; Supplier Part Number 1: 670-2516-1-ND; Stock 1: 30104; Pricing 1: 1=1,45000, 10=1,26500, 25=1,21120, 50=1,18440, 100=1,13060, 250=1,02292 (USD); RoHS: Yes; ComponentLink7URL: https://datasheet.ciiva.com/417/sj110634-417626.pdf?src-supplier=Digi-Key; ComponentLink7Description: https://datasheet.ciiva.com/417/sj110634-417626.pdf?src-supplier=Digi-Key; ComponentLink8URL: https://datasheet.ciiva.com/417/sj110634-417627.pdf?src-supplier=Digi-Key; ComponentLink8Description: https://datasheet.ciiva.com/417/sj110634-417627.pdf?src-supplier=Digi-Key; ComponentLink9URL: https://datasheet.ciiva.com/417/sj110634-417628.pdf?src-supplier=Digi-Key; ComponentLink9Description: https://datasheet.ciiva.com/417/sj110634-417628.pdf?src-supplier=Digi-Key; ComponentLink10URL: https://datasheet.ciiva.com/14644/70040279-14644764.pdf?src-supplier=Allied+Electronics; ComponentLink10Description: https://datasheet.ciiva.com/14644/70040279-14644764.pdf?src-supplier=Allied+Electronics
J4 = nano_SIM_SIM8066-6-1-14-01-A: Part Description: 7 (6 + 1) Position Card Connector NANO SIM Surface Mount, Right Angle Gold; Manufacturer: Global Connector Technology; Supplier 1: Farnell; Supplier Part Number 1: 3772948; Manufacturer Part Number 1: SIM8066-6-1-14-01-A; Stock 1: 1500; Pricing 1: 1500=1,00000, 7500=0,93000, 15000=0,86600, 30000=0,81900 (EUR); RoHS: No
J5 J6 = Header3P: Header, 3-pin; Manufacturer 1: Wurth Electronics; Manufacturer Part Number: 61300311121; Part Description: Connector Header Through Hole 3 position 0.100" (2.54mm); Number of Positions: 3; Gender: Male; Connector Type: Male Pin; Pitch: 0.1inch; Supplier 1: Digi-Key; Supplier Part Number 1: 732-5316-ND; Stock 1: 95926; Pricing 1: 1=0,13000, 10=0,11300, 25=0,09400, 50=0,07900, 100=0,07100, 1000=0,06600 (USD); RoHS: Yes; Mount: Through Hole; Contact Plating: Gold; Contact Material: Copper; Color: Black; Number of Rows: 1; Packaging: Bulk; Termination: Solder; Number of Contacts: 3; Contact Mating Length: 0.236inch; REACH SVHC: Unknown; Lead Free: Lead Free; RoHS Compliant: Yes; ComponentLink1URL: http://www.farnell.com/cad/1737268.pdf?src-supplier=Element14; ComponentLink1Description: http://www.farnell.com/cad/1737268.pdf?src-supplier=Element14; ComponentLink2URL: https://katalog.we-online.de/em/datasheet/6130xx11121.pdf?src-supplier=Digi-Key; ComponentLink2Description: https://katalog.we-online.de/em/datasheet/6130xx11121.pdf?src-supplier=Digi-Key; Manufacturer: Wurth Electronics; Manufacturer Part Number 1: 61300311121
MECH1 MECH3 MECH5 MECH7 MECH9 MECH11 = Universal_mech_screw: Part Description: M2x0.4 Pan Head Machine Screw Phillips Drive; Manufacturer: B&F Fastener; Manufacturer Part Number 1: MPMS0020005PH; Plating: Zinc; Head Diameter: 0.152inch; Head Height: 0.06inch; Supplier 1: Digi-Key; Supplier Part Number 1: H738-ND; Stock 1: 0; RoHS: Yes; Mount: Screw; Package Quantity: 100; Length: 0.257inch; Thread Size: M2; ComponentLink1URL: https://datasheet.ciiva.com/1034/metd7985a-1034171.pdf?src-supplier=Digi-Key; ComponentLink1Description: https://datasheet.ciiva.com/1034/metd7985a-1034171.pdf?src-supplier=Digi-Key
MECH2 MECH4 MECH6 MECH8 MECH10 MECH12 = Universal_mech_nut_v2: Manufacturer: Wurth Electronics; Manufacturer Part Number 1: 9774015243R; Part Description: RND STANDOFF M2X0.4 STEEL 1.5MM; Outside Diameter: 0.171inch; Plating: Tin; Threaded/Unthreaded: Threaded; Thread Size: M2X0.4; ComponentLink1Description: http://www.mouser.com/ds/2/445/9774015243R-611439.pdf?src-supplier=Mouser; ComponentLink1URL: http://www.mouser.com/ds/2/445/9774015243R-611439.pdf?src-supplier=Mouser; ComponentLink2Description: https://media.digikey.com/pdf/Data%20Sheets/Wurth%20Electronics%20PDFs/WA-SMSx_Performance_Flyer.pdf?src-supplier=Digi-Key; ComponentLink2URL: https://media.digikey.com/pdf/Data%20Sheets/Wurth%20Electronics%20PDFs/WA-SMSx_Performance_Flyer.pdf?src-supplier=Digi-Key; ComponentLink3Description: http://www.farnell.com/datasheets/1960361.pdf?src-supplier=Farnell; ComponentLink3URL: http://www.farnell.com/datasheets/1960361.pdf?src-supplier=Farnell; ComponentLink4Description: http://www.farnell.com/datasheets/1960361.pdf?src-supplier=Element14; ComponentLink4URL: http://www.farnell.com/datasheets/1960361.pdf?src-supplier=Element14; ComponentLink5Description: http://www.farnell.com/datasheets/1960361.pdf?src-supplier=Newark; ComponentLink5URL: http://www.farnell.com/datasheets/1960361.pdf?src-supplier=Newark; ComponentLink6Description: https://katalog.we-online.de/em/datasheet/9774015243R.pdf?src-supplier=Digi-Key; ComponentLink6URL: https://katalog.we-online.de/em/datasheet/9774015243R.pdf?src-supplier=Digi-Key; Length: 0.114inch; Material: Steel; Pricing 1: 1=1,16000, 10=1,09800, 50=0,97900, 100=0,89500, 500=0,83500 (USD); RoHS: Yes; Series: WA-SMSI; Stock 1: 71623; Supplier 1: Digi-Key; Supplier Part Number 1: 732-7069-1-ND
R1-R6 R8-R13 = Res_0402: Manufacturer Part Number 1: RC0402JR-070RL; Manufacturer: Yageo; Part Description: RES SMD 0.0OHM JUMPER 1/16W 0402; Resistance (Ohms): 0.0; Tolerance: Jumper; Power (Watts): 0.063W, 1/16W; Value: 0R; Supplier 1: Digi-Key; Supplier Part Number 1: 311-0.0JRTR-ND; Category: Resistors; Temperature Coefficient: -; Features: Moisture Resistant; Supplier Device Package: 0402; Height: 0.016" (0.40mm); Package / Case: 0402 (1005 Metric); Operating Temperature: -55°C ~ 155°C; Size / Dimension: 0.039" L x 0.020" W (1.00mm x 0.50mm); Composition: Thick Film; Packaging: Tape & Reel (TR); Number of Terminations: 2; RoHS: RoHS Compliant
R7 = Res_0402: Manufacturer Part Number 1: CRCW08050000Z0EA; Manufacturer: Vishay Dale; Part Description: RES SMD 0.0 OHM JUMPER 1/8W 0805; Power (Watts): 0.125W, 1/8W; Resistance (Ohms): 0.0; Tolerance: Jumper; Value: 0R; Supplier 1: Digi-Key; Supplier Part Number 1: 541-0.0ATR-ND; Package / Case: 0805 (2012 Metric); Height: 0.020" (0.50mm); Packaging: Tape & Reel (TR); Operating Temperature: -55°C ~ 155°C; Temperature Coefficient: -; RoHS: RoHS Compliant; Size / Dimension: 0.079" L x 0.049" W (2.00mm x 1.25mm); Supplier Device Package: 0805 (2012 Metric); Number of Terminations: 2; Category: Resistors; Features: Automotive AEC-Q200; Composition: Thick Film

## Sheet 07_Misc_2.SchDoc: Misc 2
size A3; Organization: Lime Microsystems; Address1: Surrey Tech Centre; Address2: Guildford GU2 7YG; Address3: Surrey; Address4: United Kingdom; Revision: 1.5; SheetNumber: 7; SheetTotal: 15
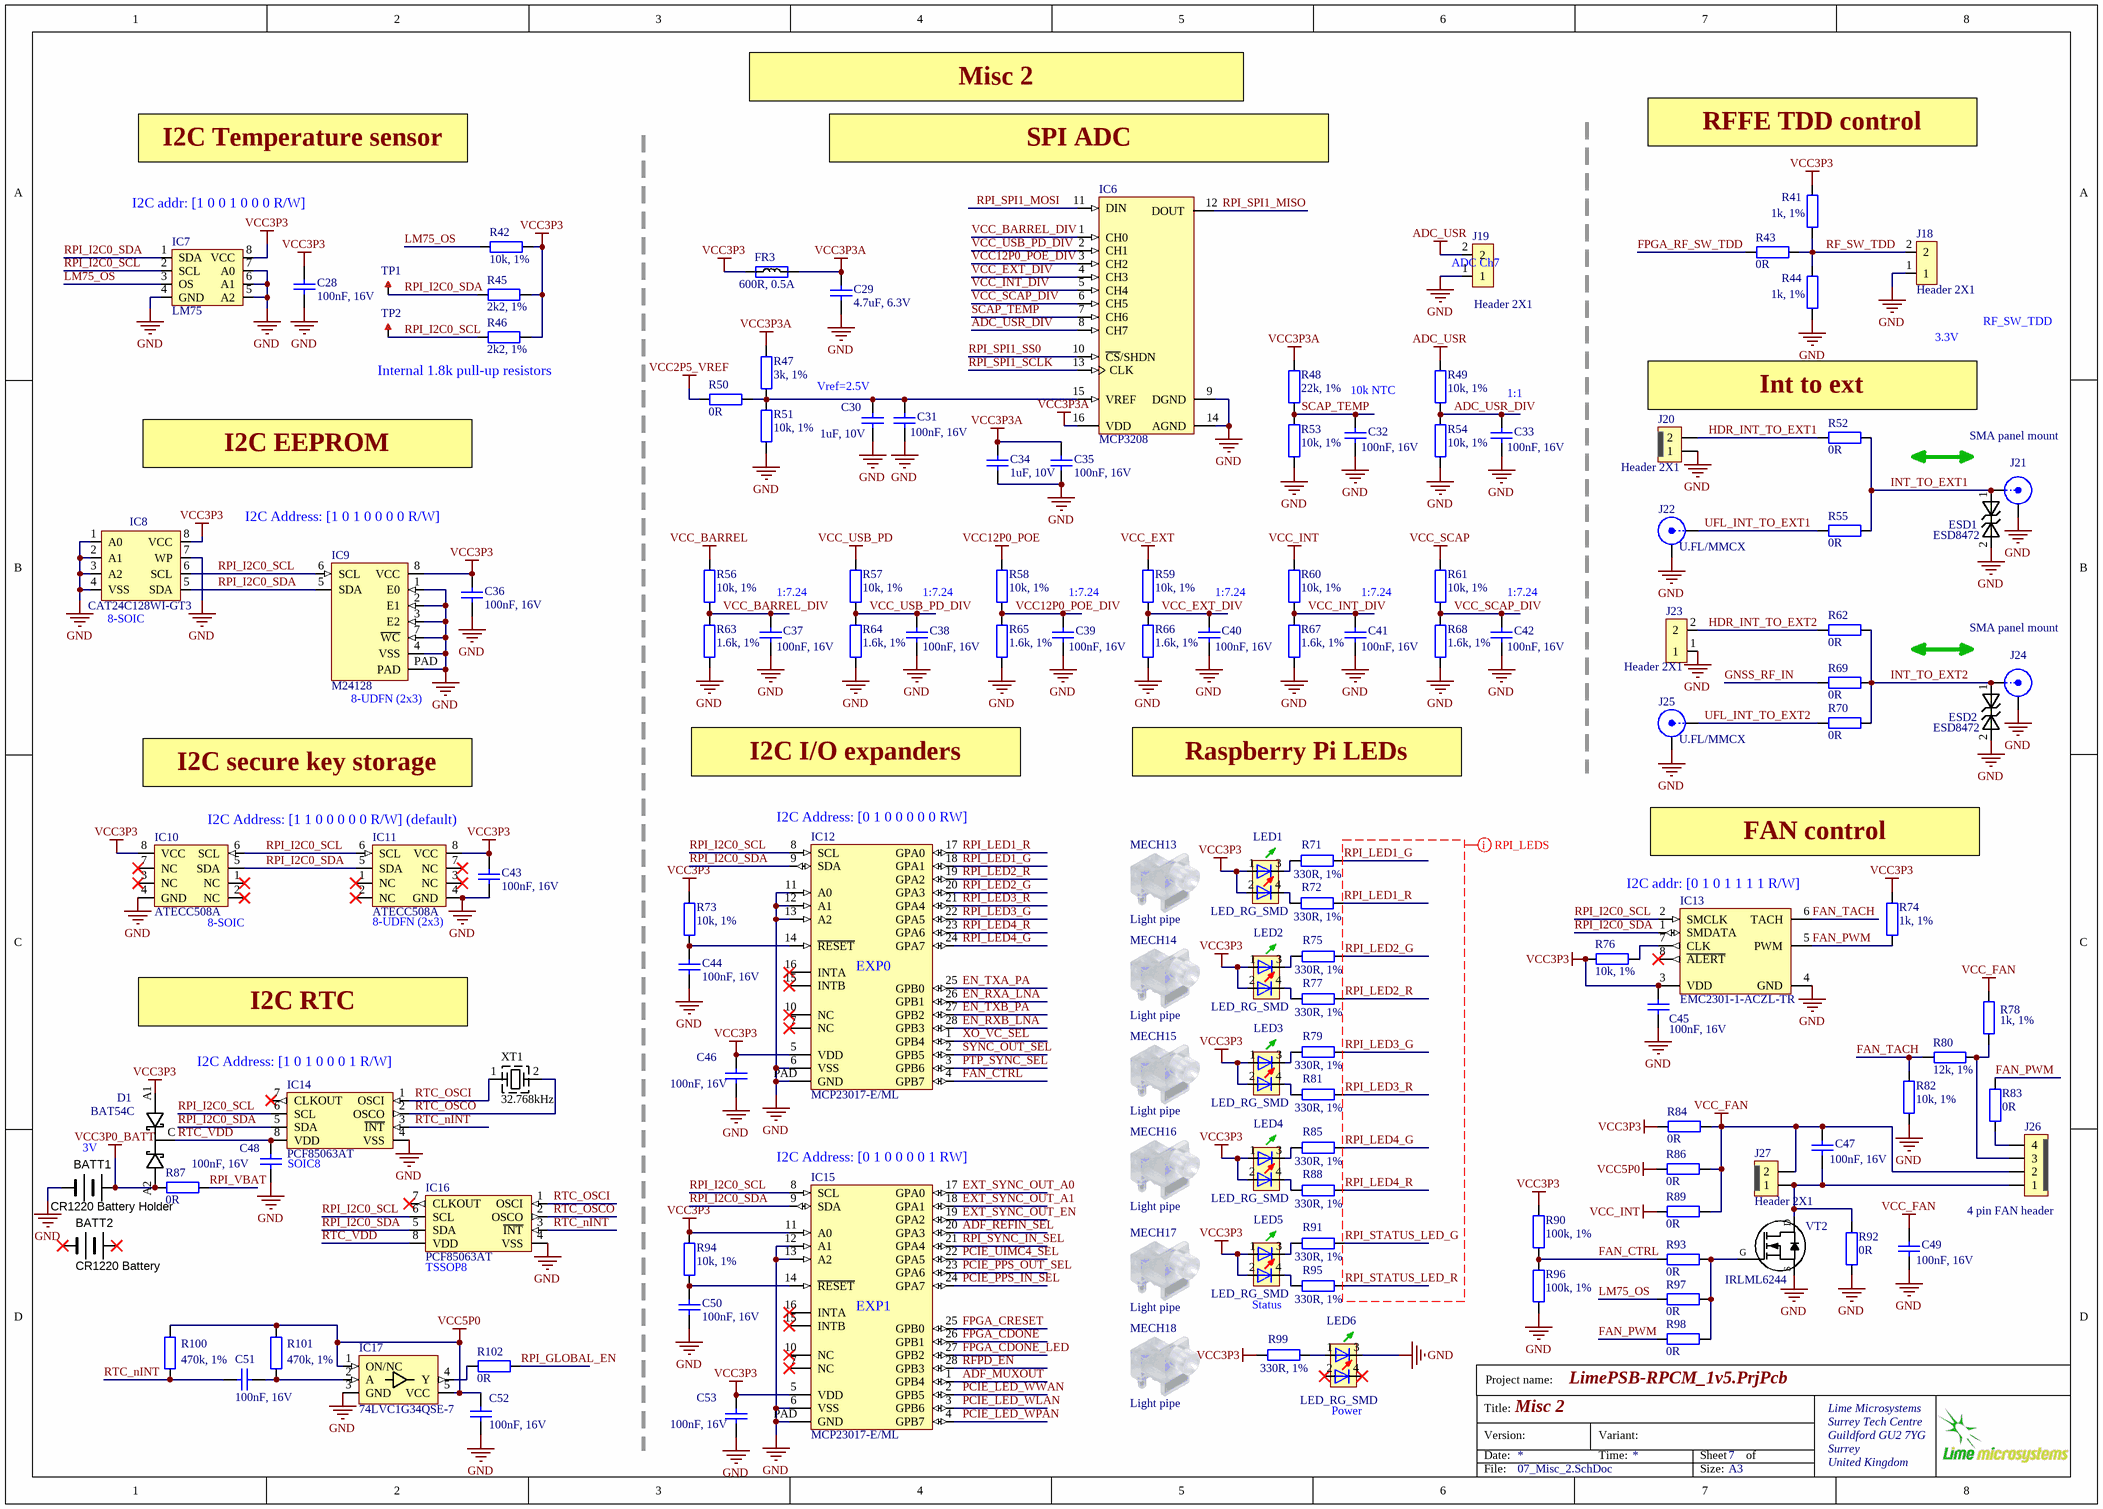
[diagram p3: 07_Misc_2.SchDoc]

### Parts
BATT1  CR1220 Battery Holder  [CR1220_SMD_holder]
BATT2  CR1220 Battery  (mechanical)
C28  100nF, 16V  [CAP0402]
C29  4.7uF, 6.3V  [CAP0402]
C30  1uF, 10V  [CAP0402]
C31  100nF, 16V  [CAP0402]
C32  100nF, 16V  [CAP0402]
C33  100nF, 16V  [CAP0402]
C34  1uF, 10V  [CAP0402]
C35  100nF, 16V  [CAP0402]
C36  100nF, 16V  [CAP0402]
C37  100nF, 16V  [CAP0402]
C38  100nF, 16V  [CAP0402]
C39  100nF, 16V  [CAP0402]
C40  100nF, 16V  [CAP0402]
C41  100nF, 16V  [CAP0402]
C42  100nF, 16V  [CAP0402]
C43  100nF, 16V  [CAP0402]
C44  100nF, 16V  [CAP0402]
C45  100nF, 16V  [CAP0402]
C46  100nF, 16V  [CAP0402]
C47  100nF, 16V  [CAP0402]
C48  100nF, 16V  [CAP0402]
C49  100nF, 16V  [CAP0402]
C50  100nF, 16V  [CAP0402]
C51  100nF, 16V  [CAP0402]
C52  100nF, 16V  [CAP0402]
C53  100nF, 16V  [CAP0402]
D1  BAT54C  [BAT54C_SOT23-3]
ESD1  ESD8472  [ESD8472_X3DFN2]
ESD2  ESD8472  [ESD8472_X3DFN2]
FR3  600R, 0.5A  [RES0402]
IC6  MCP3208  [MCP3208-CI/SL_SOIC16]
IC7  LM75  [HWSON8_LM75]
IC8  CAT24C128WI-GT3  [SOIC127P600-8DL_v2]
IC9  M24128  [M24128-DFMC6TG]
IC10  ATECC508A  [SOIC127P600-8DL_v2]
IC11  ATECC508A  [ATECC508A_UDFN8]
IC12  MCP23017-E/ML  [MCP23017-E/ML_QFN28]
IC13  EMC2301-1-ACZL-TR  [EMC2301-1-ACZL-TR_MOTOR_DRIVER_TSSOP8]
IC14  PCF85063AT  [PCF85063AT_RTC_SOIC-8]
IC15  MCP23017-E/ML  [MCP23017-E/ML_QFN28]
IC16  PCF85063AT  [PCF85063AT_RTC_TSSOP8]
IC17  74LVC1G34QSE-7  [74AHCT1G126SE-7_BUFFER_SOT353]
J18  Header 2X1  [HDR_1x2]
J19  Header 2X1  [HDR_1x2]
J20  Header 2X1  [Header1x2_TH_LOCKING]
J21  SMA panel mount  [SMA_connector_side]
J22  U.FL/MMCX  [MMCX_UFL_conn_u]
J23  Header 2X1  [HDR_1x2]
J24  SMA panel mount  [SMA_connector_side]
J25  U.FL/MMCX  [MMCX_UFL_conn_u]
J26  4 pin FAN header  [Header1x4_TH_LOCKING_v2]
J27  Header 2X1  [Header1x2_TH_LOCKING]
LED1  LED_RG_SMD  [LED-2x0603]
LED2  LED_RG_SMD  [LED-2x0603]
LED3  LED_RG_SMD  [LED-2x0603]
LED4  LED_RG_SMD  [LED-2x0603]
LED5  LED_RG_SMD  [LED-2x0603]
LED6  LED_RG_SMD  [LED-2x0603]
MECH13  Light pipe  [LIGHT_PIPE_RIGHT_ANGLE_SLP3-200-100-F]
MECH14  Light pipe  [LIGHT_PIPE_RIGHT_ANGLE_SLP3-200-100-F]
MECH15  Light pipe  [LIGHT_PIPE_RIGHT_ANGLE_SLP3-200-100-F]
MECH16  Light pipe  [LIGHT_PIPE_RIGHT_ANGLE_SLP3-200-100-F]
MECH17  Light pipe  [LIGHT_PIPE_RIGHT_ANGLE_SLP3-200-100-F]
MECH18  Light pipe  [LIGHT_PIPE_RIGHT_ANGLE_SLP3-200-100-F]
R41  1k, 1%  [RES0402]
R42  10k, 1%  [RES0402]
R43  0R  [RES0402]
R44  1k, 1%  [RES0402]
R45  2k2, 1%  [RES0402]
R46  2k2, 1%  [RES0402]
R47  3k, 1%  [RES0402]
R48  22k, 1%  [RES0402]
R49  10k, 1%  [RES0402]
R50  0R  [RES0402_v2]
R51  10k, 1%  [RES0402]
R52  0R  [RES0402_v2]
R53  10k, 1%  [RES0402]
R54  10k, 1%  [RES0402]
R55  0R  [RES0402_v2]
R56  10k, 1%  [RES0402]
R57  10k, 1%  [RES0402]
R58  10k, 1%  [RES0402]
R59  10k, 1%  [RES0402]
R60  10k, 1%  [RES0402]
R61  10k, 1%  [RES0402]
R62  0R  [RES0402_v2]
R63  1.6k, 1%  [RES0402]
R64  1.6k, 1%  [RES0402]
R65  1.6k, 1%  [RES0402]
R66  1.6k, 1%  [RES0402]
R67  1.6k, 1%  [RES0402]
R68  1.6k, 1%  [RES0402]
R69  0R  [RES0402_v2]
R70  0R  [RES0402_v2]
R71  330R, 1%  [RES0402]
R72  330R, 1%  [RES0402]
R73  10k, 1%  [RES0402]
R74  1k, 1%  [RES0402]
R75  330R, 1%  [RES0402]
R76  10k, 1%  [RES0402]
R77  330R, 1%  [RES0402]
R78  1k, 1%  [RES0402]
R79  330R, 1%  [RES0402]
R80  12k, 1%  [RES0402]
R81  330R, 1%  [RES0402]
R82  10k, 1%  [RES0402]
R83  0R  [RES0402]
R84  0R  [RES0402]
R85  330R, 1%  [RES0402]
R86  0R  [RES0402]
R87  0R  [RES0402]
R88  330R, 1%  [RES0402]
R89  0R  [RES0402]
R90  100k, 1%  [RES0402]
R91  330R, 1%  [RES0402]
R92  0R  [RES0402]
R93  0R  [RES0402]
R94  10k, 1%  [RES0402]
R95  330R, 1%  [RES0402]
R96  100k, 1%  [RES0402]
R97  0R  [RES0402]
R98  0R  [RES0402]
R99  330R, 1%  [RES0402]
R100  470k, 1%  [RES0402]
R101  470k, 1%  [RES0402]
R102  0R  [RES0402]
TP1  TESTPOINT_PAD  [TP_PAD_1p5MM]  (value not drawn)  (no BOM)
TP2  TESTPOINT_PAD  [TP_PAD_1p5MM]  (value not drawn)  (no BOM)
VT2  IRLML6244  [SOT23-3]
XT1  32.768kHz  [CRYSTAL_2PIN_RTC_RT3215]

### Nets
ADC_USR: J19.2 R49.1
GND: BATT1.NEGATIVE C28.2 C29.1 C30.1 C31.2 C32.2 C33.2 C34.1 C35.1 C36.2 C37.2 C38.2 C39.2 C40.2 C41.2 C42.2 C43.2 C44.2 C45.2 C46.2 C48.2 C49.2 C50.2 C52.2 C53.2 ESD1.2 ESD2.2 IC6.9(DGND) IC6.14(AGND) IC7.4(GND) IC7.5(A2) IC7.6(A1) IC7.7(A0) IC8.1(A0) IC8.2(A1) IC8.3(A2) IC8.4(VSS) IC8.7(WP) IC9.1(E0) IC9.2(E1) IC9.3(E2) IC9.4(VSS) IC9.7(~{WC}) IC9.PAD IC10.4(GND) IC11.4(GND) IC12.6(VSS) IC12.11(A0) IC12.12(A1) IC12.13(A2) IC12.PAD(GND) IC13.4(GND) IC14.4(VSS) IC15.6(VSS) IC15.12(A1) IC15.13(A2) IC15.PAD(GND) IC16.4(VSS) IC17.3(GND) J18.1 J19.1 J20.1 J21.2(Y) J22.2(Y) J23.1 J24.2(Y) J25.2(Y) LED6.3 R44.2 R51.2 R53.2 R54.2 R63.1 R64.1 R65.1 R66.1 R67.1 R68.1 R82.2 R92.1 R96.2 VT2.S
VCC2P5_VREF: R50.1
VCC3P0_BATT: BATT1.POSITIVE D1.A2 R87.2
VCC3P3: C28.1 C36.1 C43.1 C45.1 C46.1 C53.1 D1.A1 FR3.1 IC7.8(VCC) IC8.8(VCC) IC9.8(VCC) IC10.8(VCC) IC11.8(VCC) IC12.5(VDD) IC13.3(VDD) IC15.5(VDD) IC15.11(A0) LED1.1 LED1.2 LED2.1 LED2.2 LED3.1 LED3.2 LED4.1 LED4.2 LED5.1 LED5.2 R41.1 R42.2 R45.2 R46.2 R73.2 R74.2 R76.1 R84.1 R90.1 R94.2 R99.2
VCC3P3A: C29.2 C34.2 C35.2 FR3.2 IC6.16(VDD) R47.2 R48.1
VCC5P0: C52.1 IC17.1(ON/NC) IC17.5(VCC) R86.1 R100.2 R101.2
VCC12P0_POE: R58.1
VCC_BARREL: R56.1
VCC_EXT: R59.1
VCC_FAN: C47.1 C49.1 J26.2 J27.2 R78.1 R84.2 R86.2 R89.2
VCC_INT: R60.1 R89.1
VCC_SCAP: R61.1
VCC_USB_PD: R57.1
ADC_USR_DIV: C33.1 IC6.8(CH7) R49.2 R54.1
ADF_MUXOUT: IC15.1(GPB4)
ADF_REFIN_SEL: IC15.20(GPA3)
EN_RXA_LNA: IC12.26(GPB1)
EN_RXB_LNA: IC12.28(GPB3)
EN_TXA_PA: IC12.25(GPB0)
EN_TXB_PA: IC12.27(GPB2)
EXT_SYNC_OUT_A0: IC15.17(GPA0)
EXT_SYNC_OUT_A1: IC15.18(GPA1)
EXT_SYNC_OUT_EN: IC15.19(GPA2)
FAN_CTRL: IC12.4(GPB7) R90.2 R93.1 R96.1
FAN_PWM: IC13.5(PWM) R74.1 R83.2 R98.1
FAN_TACH: IC13.6(TACH) R80.2 R82.1
FPGA_CDONE: IC15.26(GPB1)
FPGA_CDONE_LED: IC15.27(GPB2)
FPGA_CRESET: IC15.25(GPB0)
FPGA_RF_SW_TDD: R43.2
GNSS_RF_IN: R69.2
HDR_INT_TO_EXT1: J20.2 R52.2
HDR_INT_TO_EXT2: J23.2 R62.2
INT_TO_EXT1: ESD1.1 J21.1(X) R52.1 R55.1
INT_TO_EXT2: ESD2.1 J24.1(X) R62.1 R69.1 R70.1
LM75_OS: IC7.3(OS) R42.1 R97.1
PCIE_LED_WLAN: IC15.3(GPB6)
PCIE_LED_WPAN: IC15.4(GPB7)
PCIE_LED_WWAN: IC15.2(GPB5)
PCIE_PPS_IN_SEL: IC15.24(GPA7)
PCIE_PPS_OUT_SEL: IC15.23(GPA6)
PCIE_UIMC4_SEL: IC15.22(GPA5)
PTP_SYNC_SEL: IC12.3(GPB6)
RF_SW_TDD: J18.2 R41.2 R43.1 R44.1
RFPD_EN: IC15.28(GPB3)
RPI_GLOBAL_EN: R102.1
RPI_I2C0_SCL: IC7.2(SCL) IC8.6(SCL) IC9.6(SCL) IC10.6(SCL) IC11.6(SCL) IC12.8(SCL) IC13.2(SMCLK) IC14.6(SCL) IC15.8(SCL) IC16.6(SCL) R46.1 TP2.1
RPI_I2C0_SDA: IC7.1(SDA) IC8.5(SDA) IC9.5(SDA) IC10.5(SDA) IC11.5(SDA) IC12.9(SDA) IC13.1(SMDATA) IC14.5(SDA) IC15.9(SDA) IC16.5(SDA) R45.1 TP1.1
RPI_LED1_G: IC12.18(GPA1) R71.1
RPI_LED1_R: IC12.17(GPA0) R72.1
RPI_LED2_G: IC12.20(GPA3) R75.1
RPI_LED2_R: IC12.19(GPA2) R77.1
RPI_LED3_G: IC12.22(GPA5) R79.1
RPI_LED3_R: IC12.21(GPA4) R81.1
RPI_LED4_G: IC12.24(GPA7) R85.1
RPI_LED4_R: IC12.23(GPA6) R88.1
RPI_SPI1_MISO: IC6.12(DOUT)
RPI_SPI1_MOSI: IC6.11(DIN)
RPI_SPI1_SCLK: IC6.13(CLK)
RPI_SPI1_SS0: IC6.10(~{CS}/SHDN)
RPI_STATUS_LED_G: R91.1
RPI_STATUS_LED_R: R95.1
RPI_SYNC_IN_SEL: IC15.21(GPA4)
RPI_VBAT: R87.1
RTC_nINT: C51.1 IC14.3(~{INT}) IC16.3(~{INT}) R100.1
RTC_OSCI: IC14.1(OSCI) IC16.1(OSCI) XT1.1(X)
RTC_OSCO: IC14.2(OSCO) IC16.2(OSCO) XT1.2(X)
RTC_VDD: C48.1 D1.C IC14.8(VDD) IC16.8(VDD)
SCAP_TEMP: C32.1 IC6.7(CH6) R48.2 R53.1
SYNC_OUT_SEL: IC12.2(GPB5)
UFL_INT_TO_EXT1: J22.1(X) R55.2
UFL_INT_TO_EXT2: J25.1(X) R70.2
VCC12P0_POE_DIV: C39.1 IC6.3(CH2) R58.2 R65.2
VCC_BARREL_DIV: C37.1 IC6.1(CH0) R56.2 R63.2
VCC_EXT_DIV: C40.1 IC6.4(CH3) R59.2 R66.2
VCC_INT_DIV: C41.1 IC6.5(CH4) R60.2 R67.2
VCC_SCAP_DIV: C42.1 IC6.6(CH5) R61.2 R68.2
VCC_USB_PD_DIV: C38.1 IC6.2(CH1) R57.2 R64.2
XO_VC_SEL: IC12.1(GPB4)
NetC30_2: C30.2 C31.1 IC6.15(VREF) R47.1 R50.2 R51.1
NetC44_1: C44.1 IC12.14(~{RESET}) R73.1
NetC47_2: C47.2 J26.1 J27.1 R92.2 VT2.D
NetC50_1: C50.1 IC15.14(~{RESET}) R94.1
NetC51_2: C51.2 IC17.2(A) R101.1
NetIC13_7: IC13.7(CLK) R76.2
NetIC17_4: IC17.4(Y) R102.2
NetJ26_3: J26.3 R78.2 R80.1
NetJ26_4: J26.4 R83.1
NetLED1_3: LED1.3 R71.2
NetLED1_4: LED1.4 R72.2
NetLED2_3: LED2.3 R75.2
NetLED2_4: LED2.4 R77.2
NetLED3_3: LED3.3 R79.2
NetLED3_4: LED3.4 R81.2
NetLED4_3: LED4.3 R85.2
NetLED4_4: LED4.4 R88.2
NetLED5_3: LED5.3 R91.2
NetLED5_4: LED5.4 R95.2
NetLED6_1: LED6.1 R99.1
NetR93_2: R93.2 R97.2 R98.2 VT2.G

Not connected (* = marked no-connect by the designer): BATT2 NEGATIVE* POSITIVE*; IC10 1(NC)* 2(NC)* 3(NC)* 7(NC)*; IC11 1(NC)* 2(NC)* 3(NC)* 7(NC)*; IC12 7(NC)* 10(NC)* 15(INTB)* 16(INTA)*; IC13 8(~{ALERT})*; IC14 7(CLKOUT)*; IC15 7(NC)* 10(NC)* 15(INTB)* 16(INTA)*; IC16 7(CLKOUT)*; LED6 2* 4*

### Layout directives
net class RPI_LEDS: RPI_LED1_G, RPI_LED1_R, RPI_LED2_G, RPI_LED2_R, RPI_LED3_G, RPI_LED3_R, RPI_LED4_G, RPI_LED4_R, RPI_STATUS_LED_G, RPI_STATUS_LED_R

### Notes on the sheet
- Misc 2
- I2C Temperature sensor
- (near IC6) SPI ADC
- (near R41) RFFE TDD control
- I2C addr: [1 0 0 1 0 0 0 R/W]
- (near J19) ADC Ch7
- Internal 1.8k pull-up resistors
- 3.3V
- (near J18) RF_SW_TDD
- (near C30) Vref=2.5V
- 10k NTC
- (near C33) 1:1
- Int to ext
- I2C EEPROM
- I2C Address: [1 0 1 0 0 0 0 R/W]
- (near IC8) 8-SOIC
- 1:7.24
- (near C42) 1:7.24
- (near IC9) 8-UDFN (2x3)
- I2C secure key storage
- I2C I/O expanders
- Raspberry Pi LEDs
- I2C Address: [1 1 0 0 0 0 0 R/W] (default)
- (near IC12) I2C Address: [0 1 0 0 0 0 0 RW]
- FAN control
- (near IC11) 8-UDFN (2x3)
- (near IC13) I2C addr: [0 1 0 1 1 1 1 R/W]
- (near IC10) 8-SOIC
- (near IC12) EXP0
- I2C RTC
- (near IC14) I2C Address: [1 0 1 0 0 0 1 R/W]
- (near BATT1) 3V
- SOIC8
- (near IC15) I2C Address: [0 1 0 0 0 0 1 RW]
- (near IC16) TSSOP8
- (near IC15) EXP1
- Status
- (near LED6) Power
- Project name:
- Title:
- Version:
- Date:
- Variant:
- Time:
- Sheet
- of
- File:
- Size:
- A3